# Altium schematic sheet 03. POWER.SchDoc
size A2
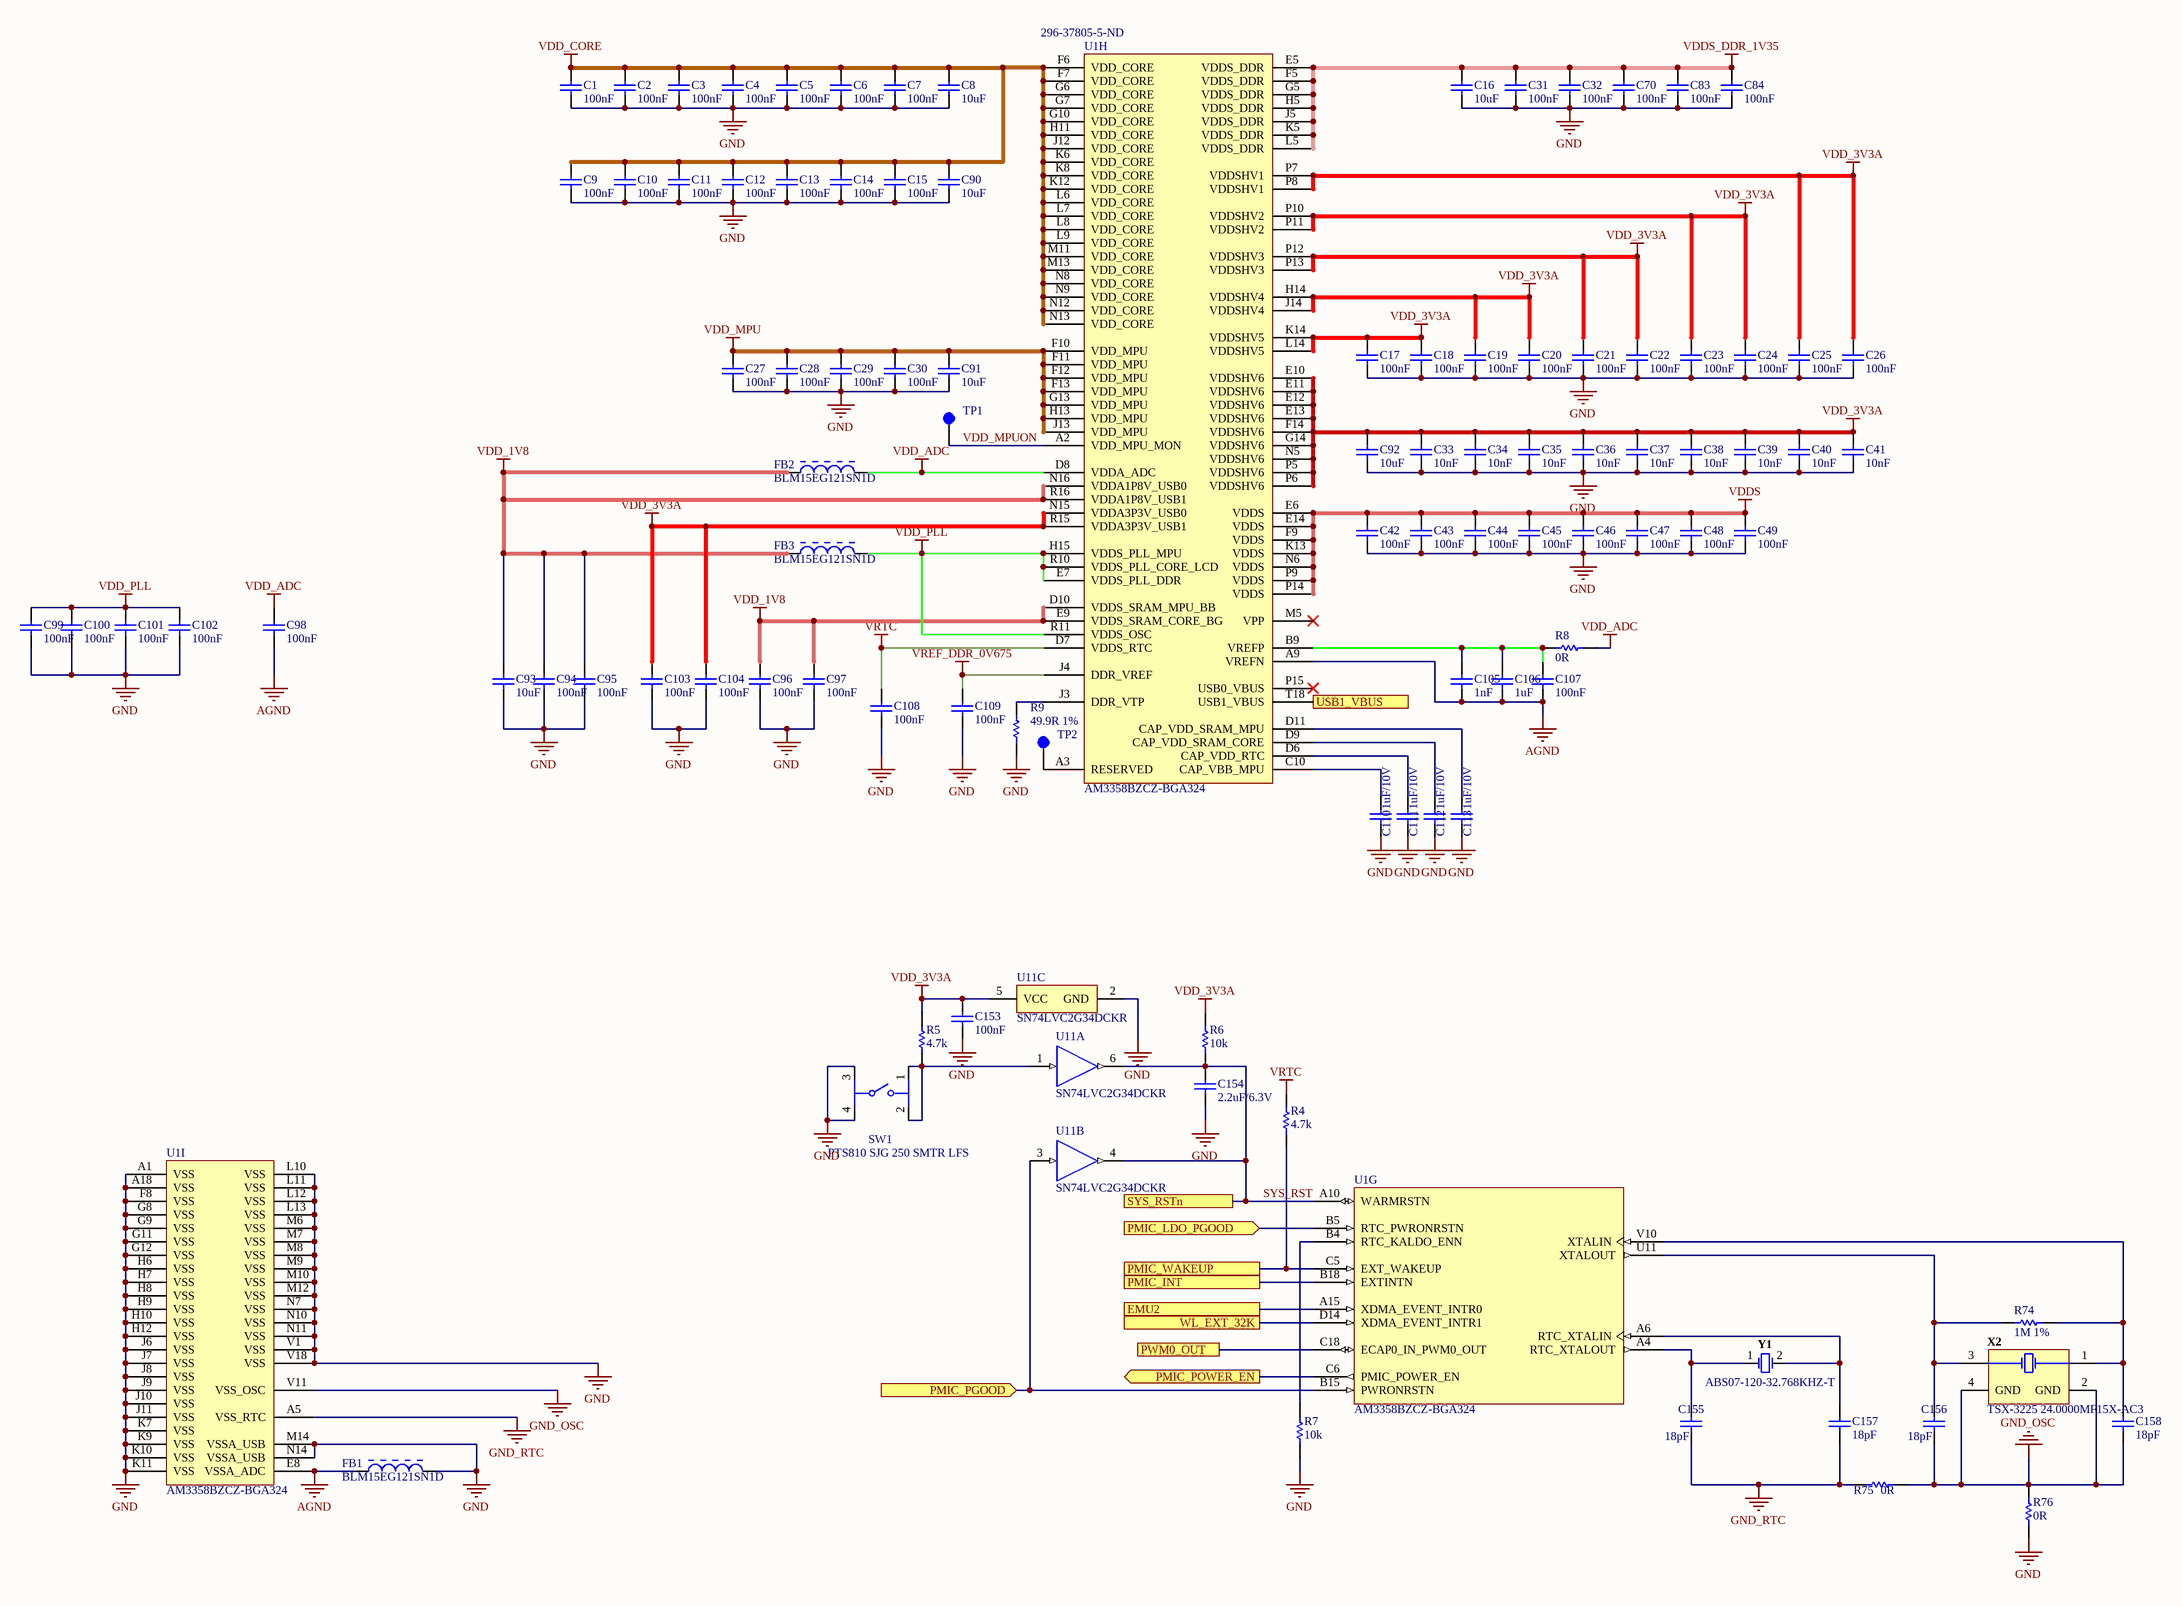
[diagram p0: 03. POWER.SchDoc]

## Parts
C1  100nF  [CAPC1005X60X30LL05T10]
C2  100nF  [CAPC1005X60X30LL05T10]
C3  100nF  [CAPC1005X60X30LL05T10]
C4  100nF  [CAPC1005X60X30LL05T10]
C5  100nF  [CAPC1005X60X30LL05T10]
C6  100nF  [CAPC1005X60X30LL05T10]
C7  100nF  [CAPC1005X60X30LL05T10]
C8  10uF  [CAPC1005X60X30LL05T10]
C9  100nF  [CAPC1005X60X30LL05T10]
C10  100nF  [CAPC1005X60X30LL05T10]
C11  100nF  [CAPC1005X60X30LL05T10]
C12  100nF  [CAPC1005X60X30LL05T10]
C13  100nF  [CAPC1005X60X30LL05T10]
C14  100nF  [CAPC1005X60X30LL05T10]
C15  100nF  [CAPC1005X60X30LL05T10]
C16  10uF  [CAPC1608X90X35NL10T15]
C17  100nF  [CAPC1005X60X30LL05T10]
C18  100nF  [CAPC1005X60X30LL05T10]
C19  100nF  [CAPC1005X60X30LL05T10]
C20  100nF  [CAPC1005X60X30LL05T10]
C21  100nF  [CAPC1005X60X30LL05T10]
C22  100nF  [CAPC1005X60X30LL05T10]
C23  100nF  [CAPC1005X60X30LL05T10]
C24  100nF  [CAPC1005X60X30LL05T10]
C25  100nF  [CAPC1005X60X30LL05T10]
C26  100nF  [CAPC1005X60X30LL05T10]
C27  100nF  [CAPC1005X60X30LL05T10]
C28  100nF  [CAPC1005X60X30LL05T10]
C29  100nF  [CAPC1005X60X30LL05T10]
C30  100nF  [CAPC1005X60X30LL05T10]
C31  100nF  [CAPC1005X60X30LL05T10]
C32  100nF  [CAPC1005X60X30LL05T10]
C33  10nF  [CAPC1005X60X30LL05T10]
C34  10nF  [CAPC1005X60X30LL05T10]
C35  10nF  [CAPC1005X60X30LL05T10]
C36  10nF  [CAPC1005X60X30LL05T10]
C37  10nF  [CAPC1005X60X30LL05T10]
C38  10nF  [CAPC1005X60X30LL05T10]
C39  10nF  [CAPC1005X60X30LL05T10]
C40  10nF  [CAPC1005X60X30LL05T10]
C41  10nF  [CAPC1005X60X30LL05T10]
C42  100nF  [CAPC1005X60X30LL05T10]
C43  100nF  [CAPC1005X60X30LL05T10]
C44  100nF  [CAPC1005X60X30LL05T10]
C45  100nF  [CAPC1005X60X30LL05T10]
C46  100nF  [CAPC1005X60X30LL05T10]
C47  100nF  [CAPC1005X60X30LL05T10]
C48  100nF  [CAPC1005X60X30LL05T10]
C49  100nF  [CAPC1005X60X30LL05T10]
C70  100nF  [CAPC1005X60X30LL05T10]
C83  100nF  [CAPC1005X60X30LL05T10]
C84  100nF  [CAPC1005X60X30LL05T10]
C90  10uF  [CAPC1005X60X30LL05T10]
C91  10uF  [RESC1005X40X25LL05T05]
C92  10uF  [CAPC1608X90X35NL10T15]
C93  10uF  [CAPC1608X90X35NL10T15]
C94  100nF  [CAPC1005X60X30LL05T10]
C95  100nF  [CAPC1005X60X30LL05T10]
C96  100nF  [CAPC1005X60X30LL05T10]
C97  100nF  [CAPC1005X60X30LL05T10]
C98  100nF  [RESC1005X40X25LL05T05]
C99  100nF  [RESC1005X40X25LL05T05]
C100  100nF  [RESC1005X40X25LL05T05]
C101  100nF  [RESC1005X40X25LL05T05]
C102  100nF  [RESC1005X40X25LL05T05]
C103  100nF  [CAPC1005X60X30LL05T10]
C104  100nF  [CAPC1005X60X30LL05T10]
C105  1nF  [CAPC1005X60X30LL05T10]
C106  1uF  [CAPC1005X55X25NL05T10]
C107  100nF  [CAPC1005X60X30LL05T10]
C108  100nF  [CAPC1005X60X30LL05T10]
C109  100nF  [CAPC1005X60X30LL05T10]
C110  1uF/10V  [CAPC1005X55X25NL05T10]
C111  1uF/10V  [CAPC1005X55X25NL05T10]
C112  1uF/10V  [CAPC1005X55X25NL05T10]
C113  1uF/10V  [CAPC1005X55X25NL05T10]
C153  100nF  [CAPC1005X55X25LL05T10]
C154  2.2uF/6.3V  [CAPC1005X60X30LL05T10]
C155  18pF  [CAPC1005X60X30LL05T10]
C156  18pF  [CAPC1005X60X30LL05T10]
C157  18pF  [CAPC1005X60X30LL05T10]
C158  18pF  [CAPC1005X60X30LL05T10]
FB1  BLM15EG121SN1D  [MURA-BLM15-CHIP-2_V]
FB2  BLM15EG121SN1D  [MURA-BLM15-CHIP-2_V]
FB3  BLM15EG121SN1D  [MURA-BLM15-CHIP-2_V]
R4  4.7k  [RESC1005X40X25LL05T05]
R5  4.7k  [RESC1005X40X25LL05T05]
R6  10k  [RESC1005X40X25LL05T05]
R7  10k  [RESC1005X40X25LL05T05]
R8  0R  [RESC1005X40X25LL05T05]
R9  49.9R 1%  [RESC1005X40X25LL05T05]
R74  1M 1%  [RESC1005X40X25LL05T05]
R75  0R  [RESC1005X40X25LL05T05]
R76  0R  [RESC1005X40X25LL05T05]
SW1  PTS810 SJG 250 SMTR LFS  [FP-PTS810_SJG_250_SMTR_LF-MFG]
TP1  Test Point  [TP]  (value not drawn)
TP2  Test Point  [TP]  (value not drawn)
U1  AM3358BZCZ-BGA324  [TI-ZCZ324]  (parts G,H,I of 11)
U11  SN74LVC2G34DCKR  [DCK0006A_L]  (parts A,B,C of 3)
X2  TSX-3225 24.0000MF15X-AC3  [FP-NX3225SA-MFG]
Y1  ABS07-120-32.768KHZ-T  [ABRA-ABS07_A_V]

## Ports
EMU2, PMIC_INT, PMIC_LDO_PGOOD (in), PMIC_PGOOD (in), PMIC_POWER_EN (out), PMIC_WAKEUP, PWM0_OUT, SYS_RSTn, USB1_VBUS, WL_EXT_32K

## Nets
AGND: C98.1 C105.1 C106.1 C107.1 FB1.1 U1.A9(VREFN) U1.E8(VSSA_ADC)
GND: C1.1 C2.1 C3.1 C4.1 C5.1 C6.1 C7.1 C8.1 C9.1 C10.1 C11.1 C12.1 C13.1 C14.1 C15.1 C16.1 C17.1 C18.1 C19.1 C20.1 C21.1 C22.1 C23.1 C24.1 C25.1 C26.1 C27.1 C28.1 C29.1 C30.1 C31.1 C32.1 C33.1 C34.1 C35.1 C36.1 C37.1 C38.1 C39.1 C40.1 C41.1 C42.1 C43.1 C44.1 C45.1 C46.1 C47.1 C48.1 C49.1 C70.1 C83.1 C84.1 C90.1 C91.1 C92.1 C93.1 C94.1 C95.1 C96.1 C97.1 C99.1 C100.1 C101.1 C102.1 C103.1 C104.1 C108.1 C109.1 C110.1 C111.1 C112.1 C113.1 C153.1 C154.1 FB1.2 R7.1 R9.1 R76.1 SW1.3 SW1.4 U1.A1(VSS) U1.A18(VSS) U1.F8(VSS) U1.G8(VSS) U1.G9(VSS) U1.G11(VSS) U1.G12(VSS) U1.H6(VSS) U1.H7(VSS) U1.H8(VSS) U1.H9(VSS) U1.H10(VSS) U1.H12(VSS) U1.J6(VSS) U1.J7(VSS) U1.J8(VSS) U1.J9(VSS) U1.J10(VSS) U1.J11(VSS) U1.K7(VSS) U1.K9(VSS) U1.K10(VSS) U1.K11(VSS) U1.L10(VSS) U1.L11(VSS) U1.L12(VSS) U1.L13(VSS) U1.M6(VSS) U1.M7(VSS) U1.M8(VSS) U1.M9(VSS) U1.M10(VSS) U1.M12(VSS) U1.M14(VSSA_USB) U1.N7(VSS) U1.N10(VSS) U1.N11(VSS) U1.N14(VSSA_USB) U1.V1(VSS) U1.V18(VSS) U11.2(GND)
GND_OSC: C156.1 C158.1 R75.1 R76.2 U1.V11(VSS_OSC) X2.2(GND) X2.4(GND)
GND_RTC: C155.1 C157.1 R75.2 U1.A5(VSS_RTC)
VDD_1V8: C93.2 C94.2 C95.2 C96.2 C97.2 FB2.1 FB3.1 U1.D10(VDDS_SRAM_MPU_BB) U1.E9(VDDS_SRAM_CORE_BG) U1.N16(VDDA1P8V_USB0) U1.R16(VDDA1P8V_USB1)
VDD_3V3A: C17.2 C18.2 C19.2 C20.2 C21.2 C22.2 C23.2 C24.2 C25.2 C26.2 C33.2 C34.2 C35.2 C36.2 C37.2 C38.2 C39.2 C40.2 C41.2 C92.2 C103.2 C104.2 C153.2 R5.1 R6.2 U1.E10(VDDSHV6) U1.E11(VDDSHV6) U1.E12(VDDSHV6) U1.E13(VDDSHV6) U1.F14(VDDSHV6) U1.G14(VDDSHV6) U1.H14(VDDSHV4) U1.J14(VDDSHV4) U1.K14(VDDSHV5) U1.L14(VDDSHV5) U1.N5(VDDSHV6) U1.N15(VDDA3P3V_USB0) U1.P5(VDDSHV6) U1.P6(VDDSHV6) U1.P7(VDDSHV1) U1.P8(VDDSHV1) U1.P10(VDDSHV2) U1.P11(VDDSHV2) U1.P12(VDDSHV3) U1.P13(VDDSHV3) U1.R15(VDDA3P3V_USB1) U11.5(VCC)
VDD_ADC: C98.2 FB2.2 R8.2 U1.D8(VDDA_ADC)
VDD_CORE: C1.2 C2.2 C3.2 C4.2 C5.2 C6.2 C7.2 C8.2 C9.2 C10.2 C11.2 C12.2 C13.2 C14.2 C15.2 C90.2 U1.F6(VDD_CORE) U1.F7(VDD_CORE) U1.G6(VDD_CORE) U1.G7(VDD_CORE) U1.G10(VDD_CORE) U1.H11(VDD_CORE) U1.J12(VDD_CORE) U1.K6(VDD_CORE) U1.K8(VDD_CORE) U1.K12(VDD_CORE) U1.L6(VDD_CORE) U1.L7(VDD_CORE) U1.L8(VDD_CORE) U1.L9(VDD_CORE) U1.M11(VDD_CORE) U1.M13(VDD_CORE) U1.N8(VDD_CORE) U1.N9(VDD_CORE) U1.N12(VDD_CORE) U1.N13(VDD_CORE)
VDD_MPU: C27.2 C28.2 C29.2 C30.2 C91.2 U1.F10(VDD_MPU) U1.F11(VDD_MPU) U1.F12(VDD_MPU) U1.F13(VDD_MPU) U1.G13(VDD_MPU) U1.H13(VDD_MPU) U1.J13(VDD_MPU)
VDD_PLL: C99.2 C100.2 C101.2 C102.2 FB3.2 U1.E7(VDDS_PLL_DDR) U1.H15(VDDS_PLL_MPU) U1.R10(VDDS_PLL_CORE_LCD) U1.R11(VDDS_OSC)
VDDS: C42.2 C43.2 C44.2 C45.2 C46.2 C47.2 C48.2 C49.2 U1.E6(VDDS) U1.E14(VDDS) U1.F9(VDDS) U1.K13(VDDS) U1.N6(VDDS) U1.P9(VDDS) U1.P14(VDDS)
VDDS_DDR_1V35: C16.2 C31.2 C32.2 C70.2 C83.2 C84.2 U1.E5(VDDS_DDR) U1.F5(VDDS_DDR) U1.G5(VDDS_DDR) U1.H5(VDDS_DDR) U1.J5(VDDS_DDR) U1.K5(VDDS_DDR) U1.L5(VDDS_DDR)
VREF_DDR_0V675: C109.2 U1.J4(DDR_VREF)
VRTC: C108.2 R4.1 U1.D7(VDDS_RTC)
EMU2: U1.A15(XDMA_EVENT_INTR0) ; port EMU2
PMIC_INT: U1.B18(EXTINTN) ; port PMIC_INT
PMIC_LDO_PGOOD: U1.B5(RTC_PWRONRSTN) ; port PMIC_LDO_PGOOD
PMIC_PGOOD: U1.B15(PWRONRSTN) U11.3(2A) ; port PMIC_PGOOD
PMIC_POWER_EN: U1.C6(PMIC_POWER_EN) ; port PMIC_POWER_EN
PMIC_WAKEUP: R4.2 U1.C5(EXT_WAKEUP) ; port PMIC_WAKEUP
PWM0_OUT: U1.C18(ECAP0_IN_PWM0_OUT) ; port PWM0_OUT
SYS_RST: C154.2 R6.1 U1.A10(WARMRSTN) U11.4(2Y) U11.6(1Y) ; port SYS_RSTn
USB1_VBUS: U1.T18(USB1_VBUS) ; port USB1_VBUS
VDD_MPUON: TP1.1 U1.A2(VDD_MPU_MON)
WL_EXT_32K: U1.D14(XDMA_EVENT_INTR1) ; port WL_EXT_32K
NetC105_2: C105.2 C106.2 C107.2 R8.1 U1.B9(VREFP)
NetC110_2: C110.2 U1.C10(CAP_VBB_MPU)
NetC111_2: C111.2 U1.D6(CAP_VDD_RTC)
NetC112_2: C112.2 U1.D9(CAP_VDD_SRAM_CORE)
NetC113_2: C113.2 U1.D11(CAP_VDD_SRAM_MPU)
NetC155_2: C155.2 U1.A4(RTC_XTALOUT) Y1.1
NetC156_2: C156.2 R74.1 U1.U11(XTALOUT) X2.3(X2)
NetC157_2: C157.2 U1.A6(RTC_XTALIN) Y1.2
NetC158_2: C158.2 R74.2 U1.V10(XTALIN) X2.1(X1)
NetR5_2: R5.2 SW1.1 SW1.2 U11.1(1A)
NetR7_2: R7.2 U1.B4(RTC_KALDO_ENN)
NetR9_2: R9.2 U1.J3(DDR_VTP)
NetTP2_1: TP2.1 U1.A3(RESERVED)

Not connected (* = marked no-connect by the designer): U1 M5(VPP)* P15(USB0_VBUS)*

## Notes on the sheet
- Title
- Size:
- Date:
- Design by:
- A4
- Number:
- Time:
- Check by:
- Revision:
- Sheet
- of
- N.S.T
- https://github.com/tung080827

## Library data of the parts
C1-C7 C9-C15 C17-C32 C42-C49 C70 C83 C84 C94-C104 C107-C109 C153 = CMP-2100-03641-1: Chip Capacitor, 0.1 uF, +/- 10%, 16 V, -55 to 125 degC, 0402 (1005 Metric), RoHS, Tape and Reel; Manufacturer: Murata; Material: Ceramic; Insulation Resistance: 10GR; Voltage: 16V; Dielectric: X7R; REACH SVHC: NoSVHC; Depth: 0.5mm; Case/Package: 0402; Datasheet URL: http://psearch.en.murata.com/capacitor/product/GRM155R71C104KA88%23.pdf; Lead Free: LeadFree; Dielectric Material: Ceramic; Manufacturer URL: http://www.murata.com/; Min Operating Temperature: -55degC; Length: 1mm; Case Code (Metric): 1005; Radiation Hardening: No; Package Reference: 0402; RoHSCompliant: true; Datasheet Version: 42675.0; Thickness: 0.022inch; Packaging: TapeandReel; Voltage Rating (DC): 16V; Tolerance: 10%; Max Operating Temperature: 125degC; Package Description: 2-Pin Surface Mount Device, Body 1 x 0.5 mm; Mount: SurfaceMount; Height: 0.5mm; Width: 0.5mm; Number of Pins: 2; Voltage Rating: 16V; Case Code (Imperial): 0402; Termination: SMD/SMT; Capacitance: 100nF; Package Quantity: 1
C8 C16 C90-C93 = CMP-2006-02792-1: Part Number: GRM188R60J106ME47D; Manufacturer: Murata
C33-C41 = CMP-2100-03641-1: Chip Capacitor, 0.1 uF, +/- 10%, 16 V, -55 to 125 degC, 0402 (1005 Metric), RoHS, Tape and Reel; Manufacturer: Murata; Material: Ceramic; Insulation Resistance: 10GR; Voltage: 16V; Dielectric: X7R; Capacitance: 100nF; REACH SVHC: NoSVHC; Depth: 0.5mm; Case/Package: 0402; Datasheet URL: http://psearch.en.murata.com/capacitor/product/GRM155R71C104KA88%23.pdf; Lead Free: LeadFree; Dielectric Material: Ceramic; Manufacturer URL: http://www.murata.com/; Min Operating Temperature: -55degC; Length: 1mm; Case Code (Metric): 1005; Radiation Hardening: No; Package Reference: 0402; RoHSCompliant: true; Datasheet Version: 42675.0; Thickness: 0.022inch; Packaging: TapeandReel; Voltage Rating (DC): 16V; Tolerance: 10%; Max Operating Temperature: 125degC; Package Description: 2-Pin Surface Mount Device, Body 1 x 0.5 mm; Mount: SurfaceMount; Height: 0.5mm; Width: 0.5mm; Number of Pins: 2; Voltage Rating: 16V; Case Code (Imperial): 0402; Termination: SMD/SMT; Package Quantity: 1
C105 = CMP-2008-04254-1: Part Number: GRM1555C1H102JA01D; Manufacturer: Murata
C106 C110-C113 = CMP-2008-04556-1: Part Number: GRM155R61A105KE15D; Manufacturer: Murata
C154 = CMP-2008-02064-1: Manufacturer: Kemet; Part Number: C0402C225M9PAC7867
C155-C158 = CMP-2008-03918-1: Part Number: GRM1555C1H180JA01D; Manufacturer: Murata
FB1-FB3 = CMP-0686-00148-3: Chip Ferrite Bead for GHz Band General Use (Low DC Resistance Type), 120 Ohm, 1500 mA, -55 to 125 degC, 1 x 0.5 x 0.55 mm SMD, Tape and Reel; Manufacturer: Murata; Rated Current: 1500 mA; Impedance (at 100 MHz): 120 Ohm +/- 25%; DC Resistance: 0.095 Ohm Max.; ComponentLink3URL: http://www.murata.com/products/catalog/pdf/c31e.pdf; ComponentLink1URL: http://www.murata.com/; Packing: Tape and Reel; Operating Temperature Range: -55 to 125 degC; PackageReference: BLM15-2; ComponentLink2Description: Datasheet; PackageDescription: 2-Pin Chip, Body 1 x 0.5 mm; ComponentLink2URL: http://www.murata.com/products/catalog/pdf/c31e.pdf; Mounting Technology: Surface Mount; ComponentLink3Description: Package Specification; ComponentLink1Description: Manufacturer URL; PartNumber: BLM15EG121SN1D; DatasheetVersion: 08/2013
R4 R5 = CMP-2002-07894-1: Part Number: RC0402FR-134K7L; Manufacturer: Yageo
R6 R7 = CMP-2002-08135-1: Manufacturer: Vishay Dale; Part Number: CRCW040210K0FKED
R8 R75 R76 = CMP-2002-07912-1: Manufacturer: Yageo / Phycomp; Part Number: RC0402JR-070RL
R9 = CMP-2002-00969-1: Precision Thick Film Chip Resistors; Manufacturer: Panasonic; Part Number: ERJ-2RKF49R9X
R74 = CMP-2002-00609-3: Chip Resistor, 1 MOhm, +/- 1%, 100 mW, -55 to 155 degC, 0402 (1005 Metric), RoHS, Tape and Reel; PartNumber: ERJ-2RKF1004X; Manufacturer: Basic Passives; Voltage Rating: 50 V; Case\/Package: 0402; Resistance: 1 MOhm; Power Rating: 100 mW; Pins: 2; Max Operating Temperature: 155 degC; ComponentLink2URL: http://industrial.panasonic.com/cdbs/www-data/pdf/RDA0000/AOA0000C86.pdf; Weight: 2.8E-05oz; ComponentLink1URL: http://www.panasonic.com/; Radiation Hardening: No; Height: 0.35 mm; Case Code (Imperial): 0402; ComponentLink2Description: Datasheet; Mount: Surface Mount; ComponentLink1Description: Manufacturer URL; REACH SVHC: Yes; Length: 1 mm; Min Operating Temperature: -55 degC; Width: 0.5 mm; Package Quantity: 10000; Tolerance: 1%; PackageDescription: 2-Pin Surface Mount Device, Body 1 x 0.5 mm; RoHSCompliant: true; DatasheetVersion: 04/2015; PackageReference: 0402; Mounting Technology: Surface Mount; Case Code (Metric): 1005; Packaging: Tape and Reel
SW1 = CMP-10040-000011-1: SWITCH TACTILE SPST-NO 0.05A 16V; Manufacturer: C&K Components; Electromechanical Life: 100000Cycles; Contact Resistance: 500mΩ; Operating Force: 400gf; Current Rating: 50mA; Voltage Rating Dc: 16V; Device Class L2: Switches; Device Class L1: Electromechanical; ComponentLink2URL: https://www.ckswitches.com/media/1476/pts810.pdf; Digikey Description: SWITCH TACTILE SPST-NO 0.05A 16V; RoHS: TRUE; Temperature Range Low: -40°C; Temperature Range High: +85°C; Automotive: No; Category: Switch; ComponentLink2Description: Datasheet; Device Class L3: Tactile Switches; Mouser Description: Switch Tactile N.O. SPST Button J-Bend 0.05A 16VDC 100000Cycles 3.92N SMD T/R; Throw Configuration: SPST-NO; Package: PTS810 SJG 250 SMTR LFS; Height: 2.7mm; Octopart: https://octopart.com/pts810sjg250smtrlfs-c%26k+components-29380277; Manufacturer Part Number: PTS810 SJG 250 SMTR LFS; Temperature: -40°C to +85°C; Lead Free: Yes
TP1 TP2 = TP
U1 = AM3358BZCZ100: Sitara ARM Cortex-A8 32-Bit RISC Microprocessor, 1 GHz, SGX530 3D Graphics Engine, Programmable Real-Time Unit and Industrial Communication Subsystem (PRU-ICSS), 0 to 90 degC, 324-pin NFBGA (ZCZ), Green (RoHS & no Sb/Br); Supplier 1: Digi-Key
U11 = CMP-0859-00474-3: Dual Buffer Gate, DCK0006A, LARGE T&R; Manufacturer: Texas Instruments; Voltage(Nom)(V): 1.8,2.5,3.3,5; Schmitt Trigger: No; Rating: Catalog; Output Type: CMOS; F @ Nom Voltage(Max)(Mhz): 150; Output Drive (IOL/IOH)(Max)(mA): 32/-32; Sub-Family: Non-Inverting Buffer/Driver; Technology Family: LVC; Input Type: CMOS/TTL; ICC @ Nom Voltage(Max)(mA): 0.01; VCC(Min)(V): 1.65; Bits(#): 2; Logic: True; tpd @ Nom Voltage(Max)(ns): 8.6,4.4,4.1,3.2; VCC(Max)(V): 5.5; 3-State Output: No; Operating Temperature Range(C): -40 to 125,-40 to 85; DatasheetVersion: SCES359I; PackageReference: DCK0006A; Generic Part Number: SN74LVC2G34
X2 = CMP-2000-07333-1: MHz Range Crystal, 24 MHz, -40 to 85 degC, 4-Pin SMD, RoHS, Tape and Reel; Manufacturer: Epson; Brand: EpsonTiming; Frequency Stability: 10PPM; Frequency: 24MHz; ESR: 40Ohms; Load Capacitance: 9pF; Unit Weight: 0.000564oz; Drive Level: 200uW; Datasheet Version: 12/2015; RoHS: True; Operating Temperature Range: -40Cto+85C; Length: 3.2mm; Tolerance: 10PPM; Width: 2.5mm; Mounting Technology: SurfaceMount; Package Description: 4-Pin Surface Mount Device, Body 3.2 x 2.5 mm; Manufacturer URL: https://www.eea.epson.com/; Factory Pack Quantity: 250; Package Reference: TSX-3225; Height: 0.6mm; Mounting Style: SMD/SMT; Termination Style: SMD/SMT; Datasheet URL: https://support.epson.biz/td/api/doc_check.php?dl=brief_FA-238V_en.pdf; Type: Crystal; Series: TSX-3225; Package / Case: 3.2mmx2.5mm; Product Category: Crystals; Packaging: Reel
Y1 = CMP-2000-07587-1: Tuning Fork Crystal, 32.768 KHz, +/- 20 ppm, -40 to 85 degC, 2-Pin SMD, RoHS, Tape and Reel; Manufacturer: Abracon; Case\/Package: SMD/SMT; Series Resistance: 60KOhm; Frequency Tolerance: 20ppm; Load Capacitance: 6pF; ESR (Equivalent Series Resistance): 55KOhm; Max Operating Temperature: 85degC; Width: 0.061inch; Radiation Hardening: No; Lead Free: LeadFree; RoHSCompliant: True; Depth: 1.5mm; Datasheet URL: http://www.abracon.com/Resonators/ABS07-120-32.768kHz-T.pdf; Frequency: 32.768KHz; Termination: SMD/SMT; Manufacturer URL: http://www.abracon.com/; Package Quantity: 3000; Packaging: TapeandReel; Number of Pins: 2; Height: 0.035inch; Package Description: 2-Pin Surface Mount Device, Body 3.2 x 1.5 mm; Package Reference: ABS07; Mount: SurfaceMount; Tolerance: 20ppm; Mounting Technology: SurfaceMount; REACH SVHC: NoSVHC; Datasheet Version: 11/2014; Length: 3.2mm; Min Operating Temperature: -40degC